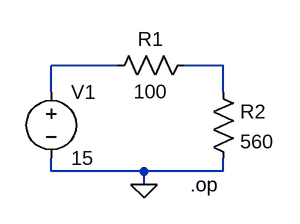
[diagram p0: schematic Norton_1_2.asc]
Norton_1_2.asc, the LTspice schematic file:
Version 4
SHEET 1 880 680
WIRE 80 96 0 96
WIRE 208 96 160 96
WIRE 0 128 0 96
WIRE 208 128 208 96
WIRE 0 224 0 208
WIRE 112 224 0 224
WIRE 208 224 208 208
WIRE 208 224 112 224
WIRE 112 240 112 224
FLAG 112 240 0
SYMBOL voltage 0 112 R0
WINDOW 123 0 0 Left 0
WINDOW 39 0 0 Left 0
SYMATTR InstName V1
SYMATTR Value 15
SYMBOL res 176 80 R90
WINDOW 0 0 56 VBottom 2
WINDOW 3 32 56 VTop 2
SYMATTR InstName R1
SYMATTR Value 100
SYMBOL res 192 112 R0
SYMATTR InstName R2
SYMATTR Value 560
TEXT 168 240 Left 2 !.op

The netlist it stands for:
* Norton_1_2.asc
V1 N001 0 15
R1 N002 N001 100
R2 N002 0 560
.op
.backanno
.end